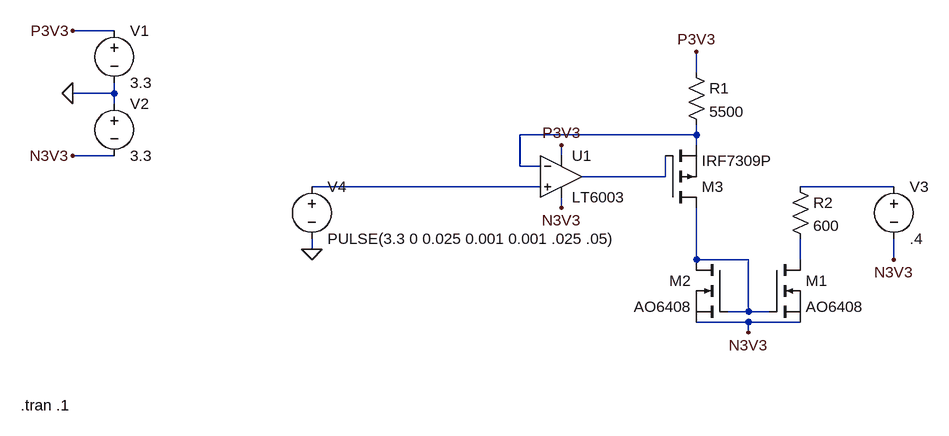
[diagram p0: schematic frontend_hys_set.asc]
frontend_hys_set.asc, the LTspice schematic file:
Version 4
SHEET 1 880 680
WIRE -448 -176 -512 -176
WIRE 448 -112 448 -144
WIRE -448 -80 -448 -96
WIRE -448 -80 -512 -80
WIRE -448 -64 -448 -80
WIRE 448 -16 448 -32
WIRE 448 -16 176 -16
WIRE 448 0 448 -16
WIRE -448 16 -512 16
WIRE 240 16 240 0
WIRE 176 32 176 -16
WIRE 208 32 176 32
WIRE 400 48 400 16
WIRE 400 48 272 48
WIRE 208 64 -144 64
WIRE 752 64 608 64
WIRE 240 96 240 80
WIRE -144 160 -144 144
WIRE 448 176 448 96
WIRE 528 176 448 176
WIRE 608 176 608 144
WIRE 752 176 752 144
WIRE 528 256 528 176
WIRE 528 256 496 256
WIRE 560 256 528 256
WIRE 528 272 448 272
WIRE 608 272 528 272
WIRE 528 288 528 272
FLAG -512 -80 0
FLAG -512 -176 P3V3
FLAG -512 16 N3V3
FLAG 752 176 N3V3
FLAG 448 -144 P3V3
FLAG 240 0 P3V3
FLAG 240 96 N3V3
FLAG -144 160 0
FLAG 528 288 N3V3
SYMBOL nmos 560 176 R0
SYMATTR InstName M1
SYMATTR Value AO6408
SYMBOL nmos 496 176 M0
SYMATTR InstName M2
SYMATTR Value AO6408
SYMBOL res 432 -128 R0
SYMATTR InstName R1
SYMATTR Value 5500
SYMBOL Opamps\\LT6003 240 48 R0
SYMATTR InstName U1
SYMBOL voltage -448 -192 R0
WINDOW 123 0 0 Left 2
WINDOW 39 0 0 Left 2
SYMATTR InstName V1
SYMATTR Value 3.3
SYMBOL voltage -448 -80 R0
WINDOW 123 0 0 Left 2
WINDOW 39 0 0 Left 2
SYMATTR InstName V2
SYMATTR Value 3.3
SYMBOL voltage 752 48 R0
WINDOW 123 0 0 Left 2
WINDOW 39 0 0 Left 2
SYMATTR InstName V3
SYMATTR Value .4
SYMBOL voltage -144 48 R0
WINDOW 123 0 0 Left 2
WINDOW 39 0 0 Left 2
SYMATTR InstName V4
SYMATTR Value PULSE(3.3 0 0.025 0.001 0.001 .025 .05)
SYMBOL res 592 48 R0
SYMATTR InstName R2
SYMATTR Value 600
SYMBOL pmos 400 96 M180
SYMATTR InstName M3
SYMATTR Value IRF7309P
TEXT -592 400 Left 2 !.tran .1

The netlist it stands for:
* frontend_hys_set.asc
M1 N006 N005 N3V3 N3V3 AO6408
M2 N005 N005 N3V3 N3V3 AO6408
R1 P3V3 N001 5500
* U1: LT6003 (symbol Opamps\LT6003 not available, pins judged from their places): In+=N003 In-=N001 V+=P3V3 V-=N3V3 OUT=N002
V1 P3V3 0 3.3
V2 0 N3V3 3.3
V3 N004 N3V3 .4
V4 N003 0 PULSE(3.3 0 0.025 0.001 0.001 .025 .05)
R2 N004 N006 600
M3 N005 N002 N001 N001 IRF7309P
.model NMOS NMOS
.model PMOS PMOS
.lib standard.mos
.tran .1
.backanno
.end